# Altium schematic sheet Power.SchDoc: HB+SPO2 | Power
size A4; DocumentNumber: 2; Revision: 2; SheetNumber: 2; SheetTotal: 4
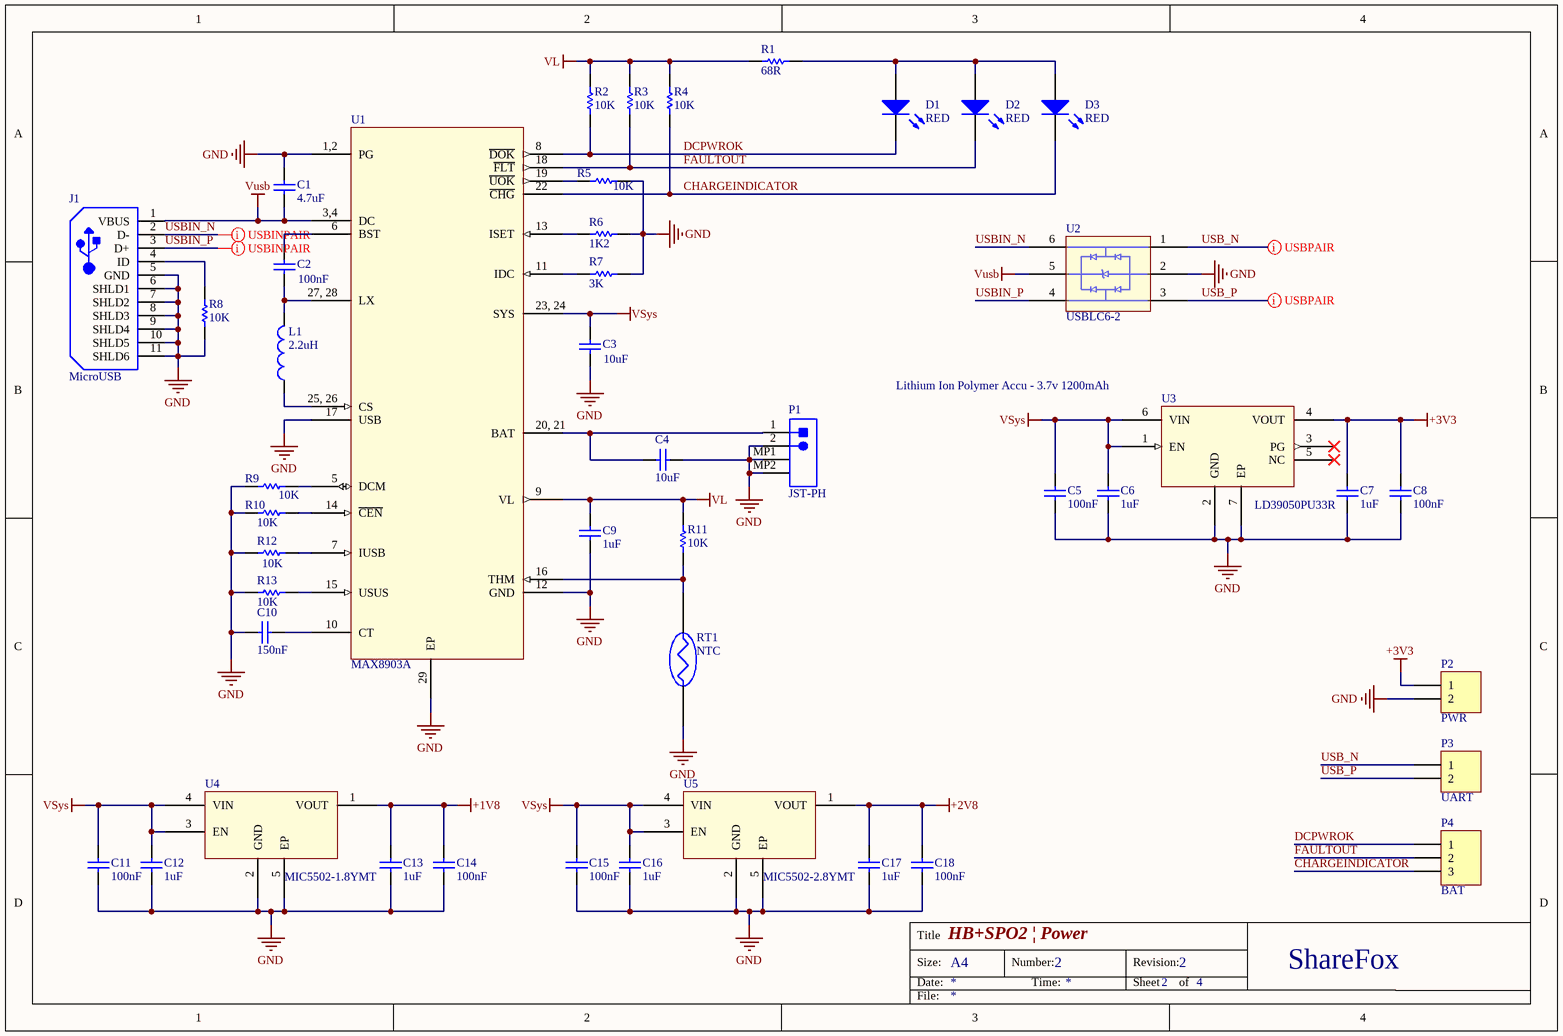
[diagram p0: Power.SchDoc]

## Parts
C1  4.7uF  [C_1206]
C2  100nF  [C_0603]
C3  10uF  [C_0805]
C4  10uF  [C_0805]
C5  100nF  [C_0603]
C6  1uF  [C_0603]
C7  1uF  [C_0603]
C8  100nF  [C_0603]
C9  1uF  [C_0603]
C10  150nF  [C_0603]
C11  100nF  [C_0603]
C12  1uF  [C_0603]
C13  1uF  [C_0603]
C14  100nF  [C_0603]
C15  100nF  [C_0603]
C16  1uF  [C_0603]
C17  1uF  [C_0603]
C18  100nF  [C_0603]
D1  RED  [D-0603]
D2  RED  [D-0603]
D3  RED  [D-0603]
J1  MicroUSB  [FCI-10118194-0001LF-5_V]
L1  2.2uH  [L-1008]
P1  JST-PH  [JST- S2B-PH-SM4-TB(LF)(SN)-2_V]
P2  PWR  [MHDR1X2]
P3  UART  [MHDR1X2]
P4  BAT  [MHDR1X3]
R1  68R  [C_0603]
R2  10K  [C_0603]
R3  10K  [C_0603]
R4  10K  [C_0603]
R5  10K  [C_0603]
R6  1K2  [C_0603]
R7  3K  [C_0603]
R8  10K  [C_0603]
R9  10K  [C_0603]
R10  10K  [C_0603]
R11  10K  [C_0603]
R12  10K  [C_0603]
R13  10K  [C_0603]
RT1  NTC  [HDR1X2]
U1  MAX8903A  [QFN28P40S400X400EP260x260]
U2  USBLC6-2  [SOT23-6P95R280X90]
U3  LD39050PU33R  [SON6P95S300X300EP237x149]
U4  MIC5502-1.8YMT  [DFN4P65S100x100EP48x48]
U5  MIC5502-2.8YMT  [DFN4P65S100x100EP48x48]

## Nets
+1V8: C13.1 C14.1 U4.1(VOUT)
+2V8: C17.1 C18.1 U5.1(VOUT)
+3V3: C7.1 C8.1 P2.1 U3.4(VOUT)
GND: C1.1 C3.1 C4.1 C5.2 C6.2 C7.2 C8.2 C9.2 C10.1 C11.2 C12.2 C13.2 C14.2 C15.2 C16.2 C17.2 C18.2 J1.5(GND) J1.6(SHLD1) J1.7(SHLD2) J1.8(SHLD3) J1.9(SHLD4) J1.10(SHLD5) J1.11(SHLD6) P1.2 P1.MP1 P1.MP2 P2.2 R5.1 R6.1 R7.1 R8.2 R9.2 R10.2 R12.2 R13.2 RT1.1 U1.1,2(PG) U1.12(GND) U1.17(USB) U1.29(EP) U2.2 U3.2(GND) U3.7(EP) U4.2(GND) U4.5(EP) U5.2(GND) U5.5(EP)
VL: C9.1 R1.2 R2.2 R3.2 R4.2 R11.1 U1.9(VL)
VSys: C3.2 C5.1 C6.1 C11.1 C12.1 C15.1 C16.1 U1.23,_24(SYS) U3.1(EN) U3.6(VIN) U4.3(EN) U4.4(VIN) U5.3(EN) U5.4(VIN)
Vusb: C1.2 J1.1(VBUS) U1.3,4(DC) U2.5
CHARGEINDICATOR: D3.2(K) P4.3 R4.1 U1.22(~{CHG})
DCPWROK: D1.2(K) P4.1 R2.1 U1.8(~{DOK})
FAULTOUT: D2.2(K) P4.2 R3.1 U1.18(~{FLT})
USB_N: P3.1 U2.1
USB_P: P3.2 U2.3
USBIN_N: J1.2(D-) U2.6
USBIN_P: J1.3(D+) U2.4
NetC2_1: C2.1 L1.2 U1.27,_28(LX)
NetC2_2: C2.2 U1.6(BST)
NetC4_2: C4.2 P1.1 U1.20,_21(BAT)
NetC10_2: C10.2 U1.10(CT)
NetD1_1: D1.1(A) D2.1(A) D3.1(A) R1.1
NetJ1_4: J1.4(ID) R8.1
NetL1_1: L1.1 U1.25,_26(CS)
NetR5_2: R5.2 U1.19(~{UOK})
NetR6_2: R6.2 U1.13(ISET)
NetR7_2: R7.2 U1.11(IDC)
NetR9_1: R9.1 U1.5(DCM)
NetR10_1: R10.1 U1.14(~{CEN})
NetR11_2: R11.2 RT1.2 U1.16(THM)
NetR12_1: R12.1 U1.7(IUSB)
NetR13_1: R13.1 U1.15(USUS)

Not connected (* = marked no-connect by the designer): U3 3(PG)* 5(NC)*

## Layout directives
differential pair: USB_N, USB_P, USBIN_N, USBIN_P

## Notes on the sheet
- (near P1) Lithium Ion Polymer Accu - 3.7v 1200mAh
- Title
- Size:
- Date:
- A4
- Number:
- Time:
- Revision:
- Sheet
- of
- ShareFox
- File:

## Library data of the parts
C1-C18 = Cap: Capacitor; Published: 8-Jun-2000; LatestRevisionDate: 17-Jul-2002; LatestRevisionNote: Re-released for DXP Platform.; PackageReference: RAD-0.3; Publisher: Altium Limited; PackageDescription: Radial Cap, Thru-Hole; 2 Leads; 0.3 in Pin Spacing
  C1: Value: 4.7uF
  C2 C5 C8 C11 C14 C15 C18: Value: 100nF
  C3 C4: Value: 10uF
  C6 C7 C9 C12 C13 C16 C17: Value: 1uF
  C10: Value: 150nF
D1-D3 = LED2: Typical RED, GREEN, YELLOW, AMBER GaAs LED; Published: 8-Jun-2000; LatestRevisionDate: 17-Jul-2002; LatestRevisionNote: Re-released for DXP Platform.; PackageVersion: Feb-2002; PackageReference: 3.2X1.6X1.1; Publisher: Altium Limited; PackageDescription: SM LED; 2 Flat Leads
J1 = CMP-2000-05120-1: Micro USB B Type Receptacle, 1.8 A, -55 to 85 degC, 5-Pin SMD, RoHS, Tape and Reel; Manufacturer: Amphenol FCI; Body Orientation: RightAngle; Number of Contacts: 5; Pitch: 0.65mm; Gender: RCP; Rad Hard: No; Package Reference: 10118194-0001LF-5; Mounting: SurfaceMount; Manufacturer URL: http://www.fci.com/; Packaging: CutTape; Datasheet URL: https://datasheet.ciiva.com/26945/getdatasheetpartid-418619-26945695.pdf; Termination Method: Solder; Package Description: 5-Pin Surface Mount Device, Body 8.05 x 5.53 mm, Pitch 0.65 mm; Type: MicroUSBTypeB; Datasheet Version: Rev. A, 10/2011
L1 = Inductor: Code_IEC: 1005; Published: 8-Jun-2000; LatestRevisionDate: 29-May-2009; LatestRevisionNote: IPC-7351 Footprint Added.; PackageReference: 0402-A; Publisher: Altium Limited; PackageDescription: Chip Inductor; Code_JEITA: 0402; Value: 2.2uH
P1 = CMP-1755-00001-1: Male Header, Pitch 2 mm, 1 x 2 Position, Height 5.5 mm, -25 to 85 degC, RoHS, Tape and Reel; Current Rating: 3 A; ComponentLink1URL: http://www.jst.com/home2.html; Radiation Hardening: No; RoHSCompliant: True; Mount: Through Hole; Contact Material: Bronze; Package Quantity: 100; Width: 2.34 mm; DatasheetVersion: Dec-12; Height: 8.13 mm; Max Operating Temperature: 105degC; ComponentLink2Description: Datasheet; Lead Pitch: 0.1 inch; Contact Finish: Lead; Packaging: Bulk; Colour: Black; Contact Plating: Tin; Min Operating Temperature: -65degC; ComponentLink1Description: Manufacturer URL; PackageReference: S2B-PH-SM4-TB(LF)(SN)-2; PackageDescription: Male Header, Pitch 2 mm, 1 x 2 Position, Height 5.5 mm; ComponentLink2URL: http://www.jst-mfg.com/product/pdf/eng/ePH.pdf; Pins: 40; Length: 101.19 mm
P2 P3 = MHDR1X2: Header, 2-Pin; LatestRevisionDate: 17-Jul-2002; LatestRevisionNote: Re-released for DXP Platform.; Publisher: Altium Limited
P4 = MHDR1X3: Header, 3-Pin; LatestRevisionDate: 17-Jul-2002; LatestRevisionNote: Re-released for DXP Platform.; Publisher: Altium Limited
R1-R13 = Res1: Resistor; Published: 8-Jun-2000; LatestRevisionDate: 17-Jul-2002; LatestRevisionNote: Re-released for DXP Platform.; PackageReference: AXIAL-0.3; Publisher: Altium Limited; PackageDescription: Axial Device, Thru-Hole; 2 Leads; 0.3 in Pin Spacing
  R1: Value: 68R
  R2-R5 R8-R13: Value: 10K
  R6: Value: 1K2
  R7: Value: 3K
RT1 = NTC/PTC: 2322-640-63103
U1 = MAX8903A: 2A 1-Cell Li+ DC-DC Chargersfor USB and Adapter Power
U2 = USBLC6-2: Very low capacitance ESD protection
U3 = LD39050PUxxR: 500 mA low quiescent current and low noise voltage regulator
U4 U5 = MIC550x-x.xYMT: Single 300mA LDO